# EasyEDA schematic SCHEMATIC_EasyEDA.json
TITLE: AFBR SiPM Carrier Board; REV: 1.0; Date: 2022-09-30; Sheet: 1/1; Drawn By: NuclearPhoenix; Company: -
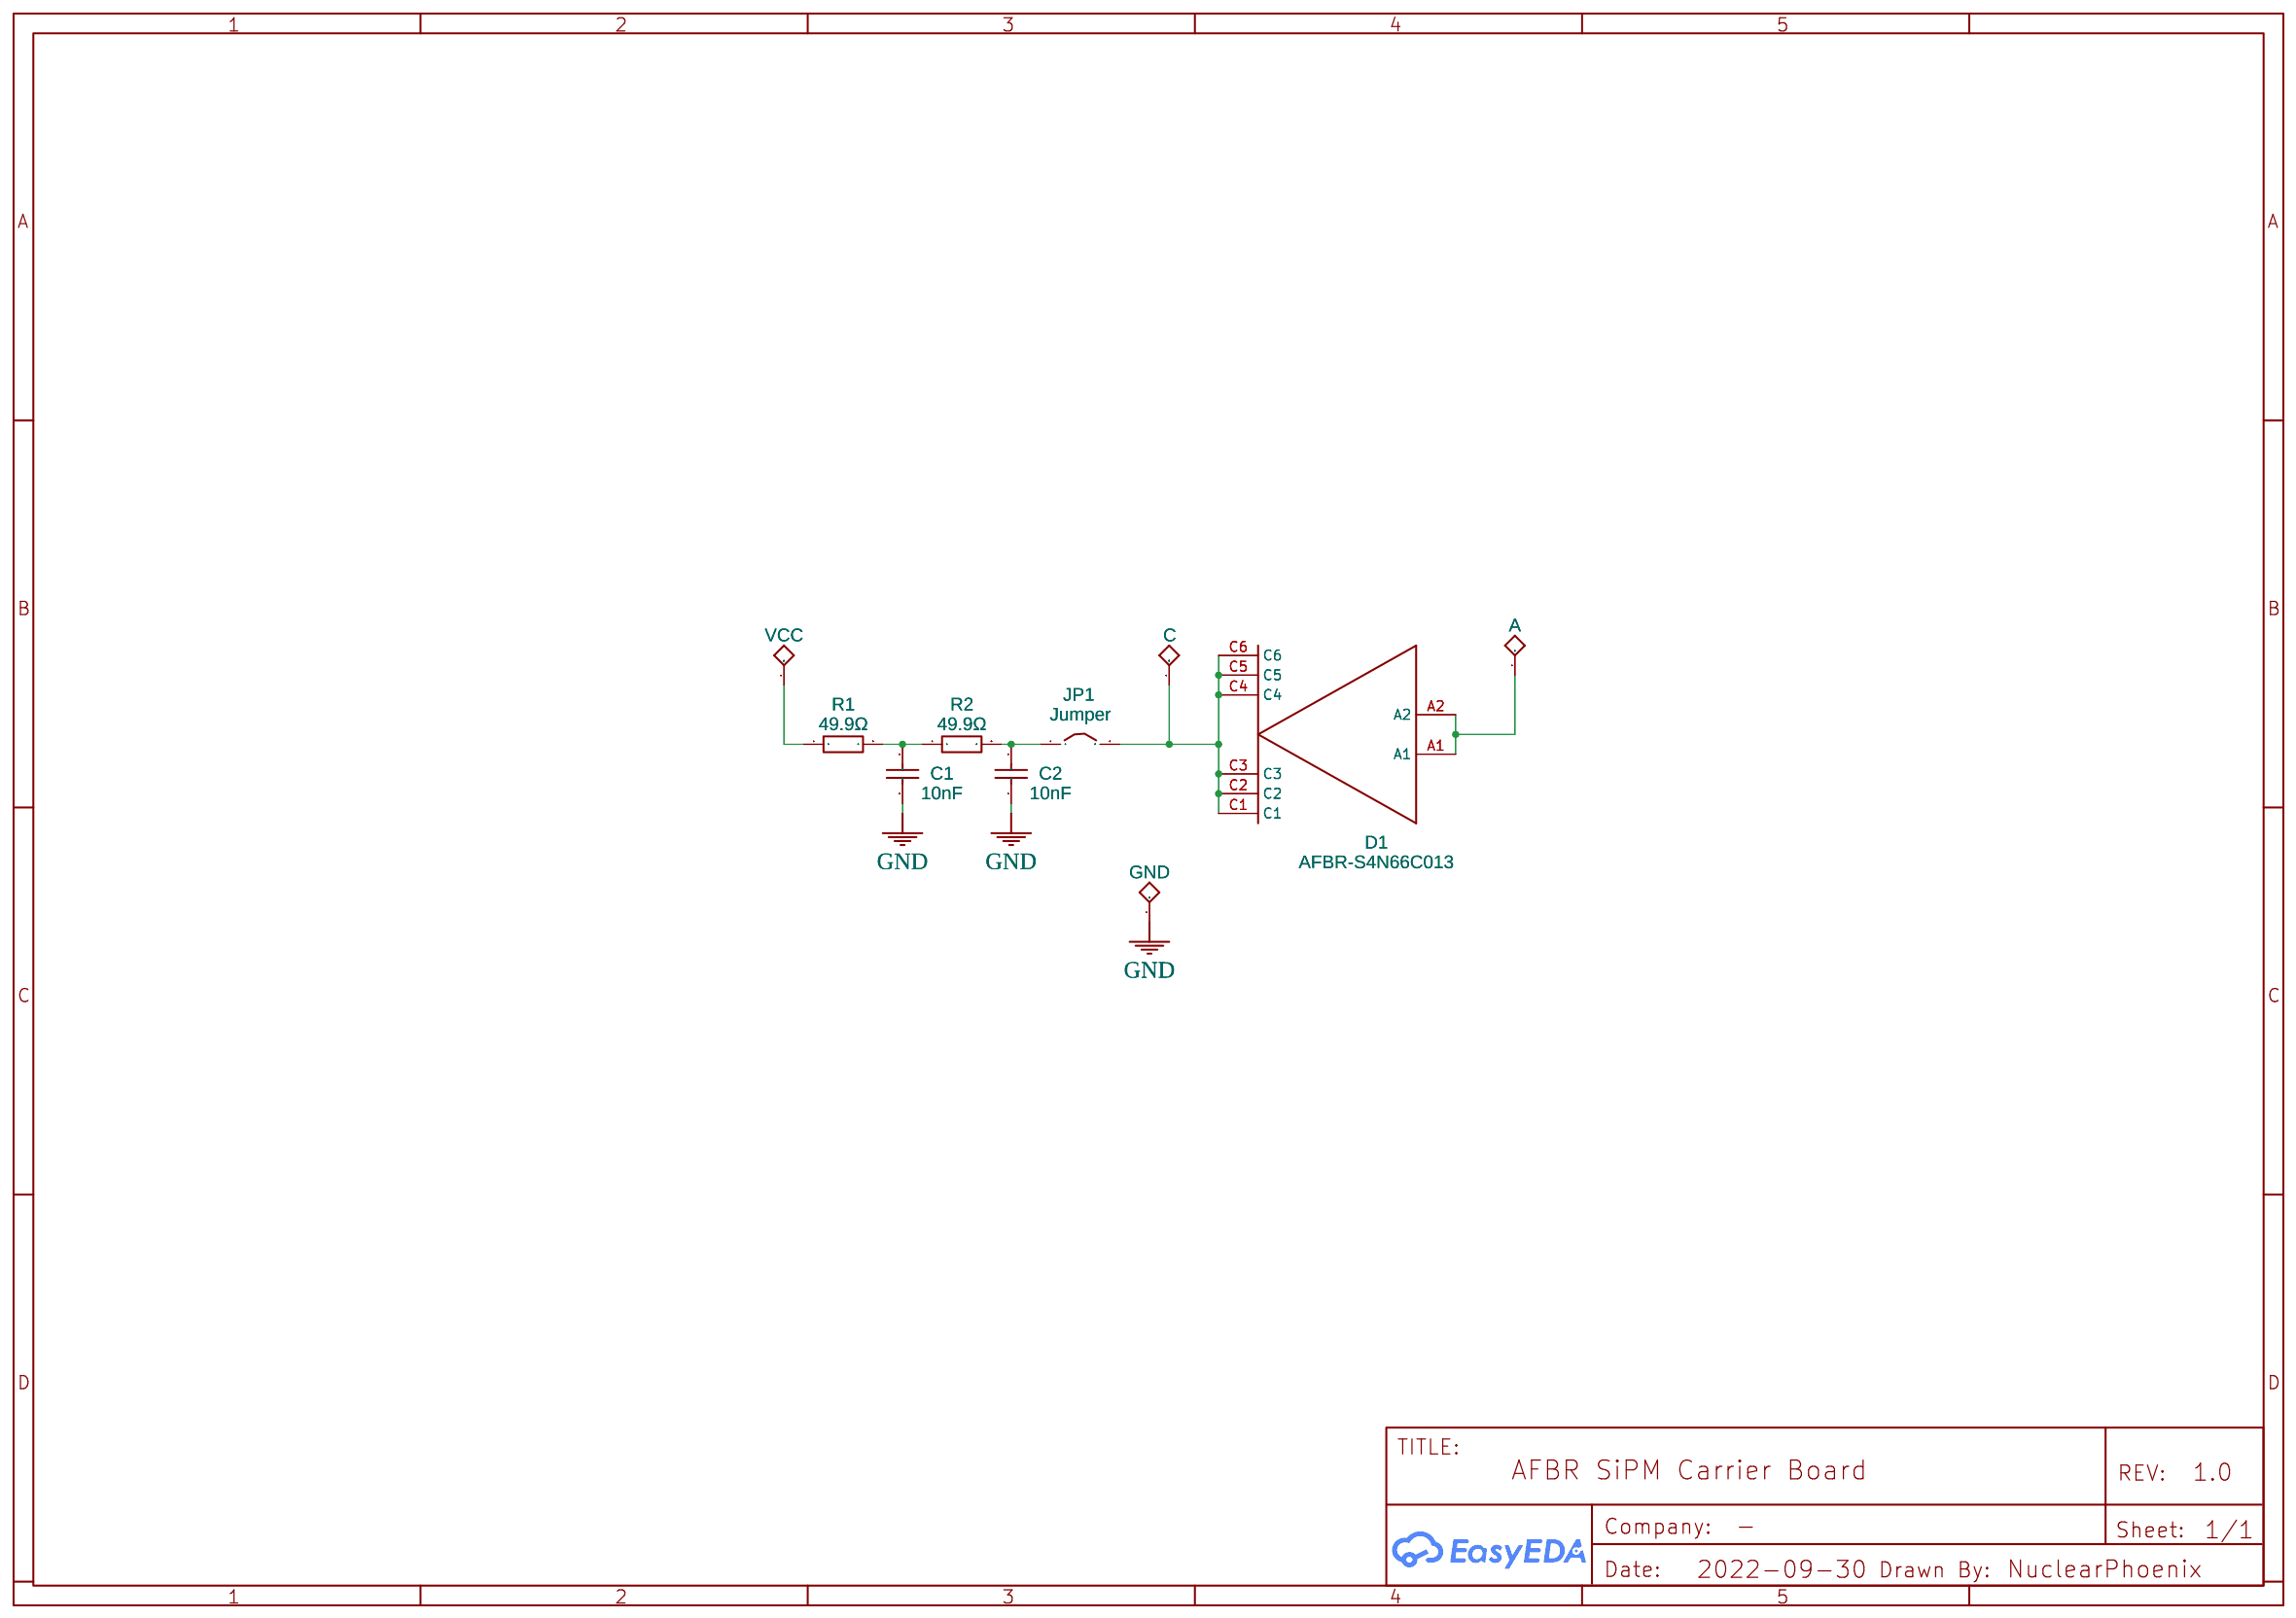
[diagram p0: schematic sheet]

## Parts
A  OUT  [WIRE-PAD_ROUND-.1]
C  VCC  [WIRE-PAD_ROUND-.1]
C1  10nF  [C0805]
C2  10nF  [C0805]
D1  AFBR-S4N66C013  [AFBR-S4N66C013]
GND  VCC  [WIRE-PAD_ROUND-.1]
JP1  Jumper  [PAD-JUMPER-2-NC_BY_PASTE_YES_SILK]
R1  49.9Ω  [R0805]
R2  49.9Ω  [R0805]
VCC  VCC  [WIRE-PAD_ROUND-.1]

## Library data of the parts
A C GND VCC = TEST_POINT-RND-.100: Contributor: Hong-Bin Tsai
C1 C2 = CL21B103KBANNNC: Supplier: LCSC; Manufacturer: SAMSUNG; Supplier Part: C1710; JLCPCB Part Class: Basic Part
D1 = AFBR-S4N66C013: Manufacturer: Broadcom / Avago; Supplier Part: 630-AFBR-S4N66C013; Supplier: Mouser; Contributor: PiotrNowak
JP1 = Jumper Solder bridge: Supplier: LCSC; Supplier Part: C21189; Manufacturer: NONE; Manufacturer Part: 0603WAF0000T5E; Contributor: Levente Mitnyik
R1 R2 = 0805W8F499JT5E: Supplier: LCSC; Manufacturer: UniOhm; Supplier Part: C17720; Resistance (Ohms): 49.9; JLCPCB Part Class: Basic Part

## Nets
GND: C1.1 C2.1 GND.1(PIN)
Net-(A-1): A.1(PIN) D1.A1 D1.A2
Net-(C1-2): C1.2 R1.2 R2.1
Net-(C2-2): C2.2 JP1.1 R2.2
Net-(C-1): C.1(PIN) D1.C1 D1.C2 D1.C3 D1.C4 D1.C5 D1.C6 JP1.2
Net-(R1-1): R1.1 VCC.1(PIN)
